# EAGLE schematic m-power-v0 (EAGLE 5.07)
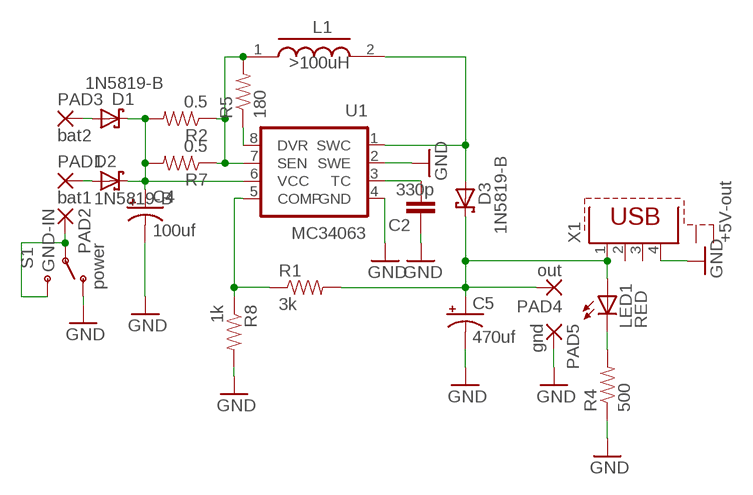
[diagram p0: schematic, sheet 1]

## Parts
C2  330p  CAPPTH  [CAP-PTH-SMALL]
C4  100uf  CAP_POLPTH1  [CPOL-RADIAL-100UF-25V]
C5  470uf  CAP_POLPTH1  [CPOL-RADIAL-100UF-25V]
D1  1N5819-B  [DO41-7.6]
D2  1N5819-B  [DO41-7.6]
D3  1N5819-B  [DO41-7.6]
L1  >100uH  INDUCTOR-IED22  [ED22]
LED1  RED  LED3MM  [LED3MM]
PAD1  bat1  3,17/1,1  [3,17/1,1]
PAD2  GND-IN  3,17/1,1  [3,17/1,1]
PAD3  bat2  3,17/1,1  [3,17/1,1]
PAD4  out  3,17/1,1  [3,17/1,1]
PAD5  gnd  3,17/1,1  [3,17/1,1]
R1  3k  RESISTOR0207/5V(1/2W)  [0207/5V]
R2  0.5  RESISTOR1/4W  [AXIAL-0.3]
R4  500  RESISTOR0204/V(1/4W)  [0204V]
R5  180  RESISTOR1/4W  [AXIAL-0.3]
R7  0.5  RESISTOR1/4W  [AXIAL-0.3]
R8  1k  RESISTOR1/4W  [AXIAL-0.3]
S1  power  SWITCH-SPST3AM6  [SWITCH-SPDT-AM#6]
U1  MC34063  [DIP08-L]
X1  +5V-out  USB-PN87520-SS  [PN87520-S]

## Nets
GND: C2.1 C4.2(-) C5.2(-) PAD5.1(P) R4.1 R8.P$2 S1.1(O) U1.2(SWE) U1.4(GND) X1.4
N$1: C2.2 U1.3(TC)
N$2: C4.1(+) D1.C D2.C R2.P$2 R7.P$2 U1.6(VCC)
N$3: R1.1 R8.P$1 U1.5(COMP)
N$4: C5.1(+) D3.C LED1.A PAD4.1(P) R1.2 X1.1
N$5: LED1.K(C) R4.2
N$6: R5.P$1 U1.8(DVR)
N$7: D2.A PAD1.1(P)
N$8: L1.1 R2.P$1 R5.P$2 R7.P$1 U1.7(SEN)
N$9: D1.A PAD3.1(P)
N$10: D3.A L1.2 U1.1(SWC)
N$11: PAD2.1(P) S1.2(P) S1.3(S)
Unconnected: X1.2 X1.3 X1.S1 X1.S2

## Library data of the parts
C2 = SparkFun:CAP: Capacitor Standard 0603 ceramic capacitor, and 0.1" leaded capacitor.
C4 C5 = SparkFun:CAP_POL: Capacitor Polarized These are standard SMD and PTH capacitors. Normally 10uF, 47uF, and 100uF in electrolytic and tantalum varieties. Always verify the external diameter of the through hole cap, it varies with capacity, voltage, and manufacturer. The EIA devices should be standard.
D1-D3 = digital-toy:1N581*: 1.0A SCHOTTKY BARRIER RECTIFIER Source: http://www.diodes.com/datasheets/ds23001.pdf
L1 = digital-toy:INDUCTOR-I: Inductors with Iron
LED1 = SparkFun:LED: LEDs Standard schematic elements and footprints for 5mm, 3mm, 1206, and 0603 sized LEDs. 5mm - Spark Fun Electronics SKU : COM-00529 (and others)
PAD1-PAD5 = wirepad:3,17/1,1: THROUGH-HOLE PAD
R1 R2 R4 R5 R7 R8 = digital-toy:RESISTOR: Resistor Basic schematic elements and footprints for 0603, 1206, and PTH 1/10th watt (small) resistors. digital-toy copy vertical mount of axial-0.3 from rcl.lbr : the 0207/xx
S1 = digital-toy:SWITCH-SPST: SPST Switch Simple slide switch. Spark Fun Electronics SKU : COM-00102
U1 = digital-toy:MC34063: digital toy dip8-l smd
X1 = digital-toy:USB-PN87520-S